# Altium schematic sheet S3 - CONNECTORS.SchDoc: CONNECTORS AND HEADERS
size A; FIELD_1: 1; FIELD_2: 2; FIELD_3: 3; FIELD_4: 4; FIELD_5: 5; FIELD_6: 6; FIELD_7: 7; FIELD_8: 8; Engineer: M. TALEBI; Organization: MACHINE INTELLIGENCE LAB; Revision: 0; Project: BLUETOOTH SYSTEM STATUS BOARD
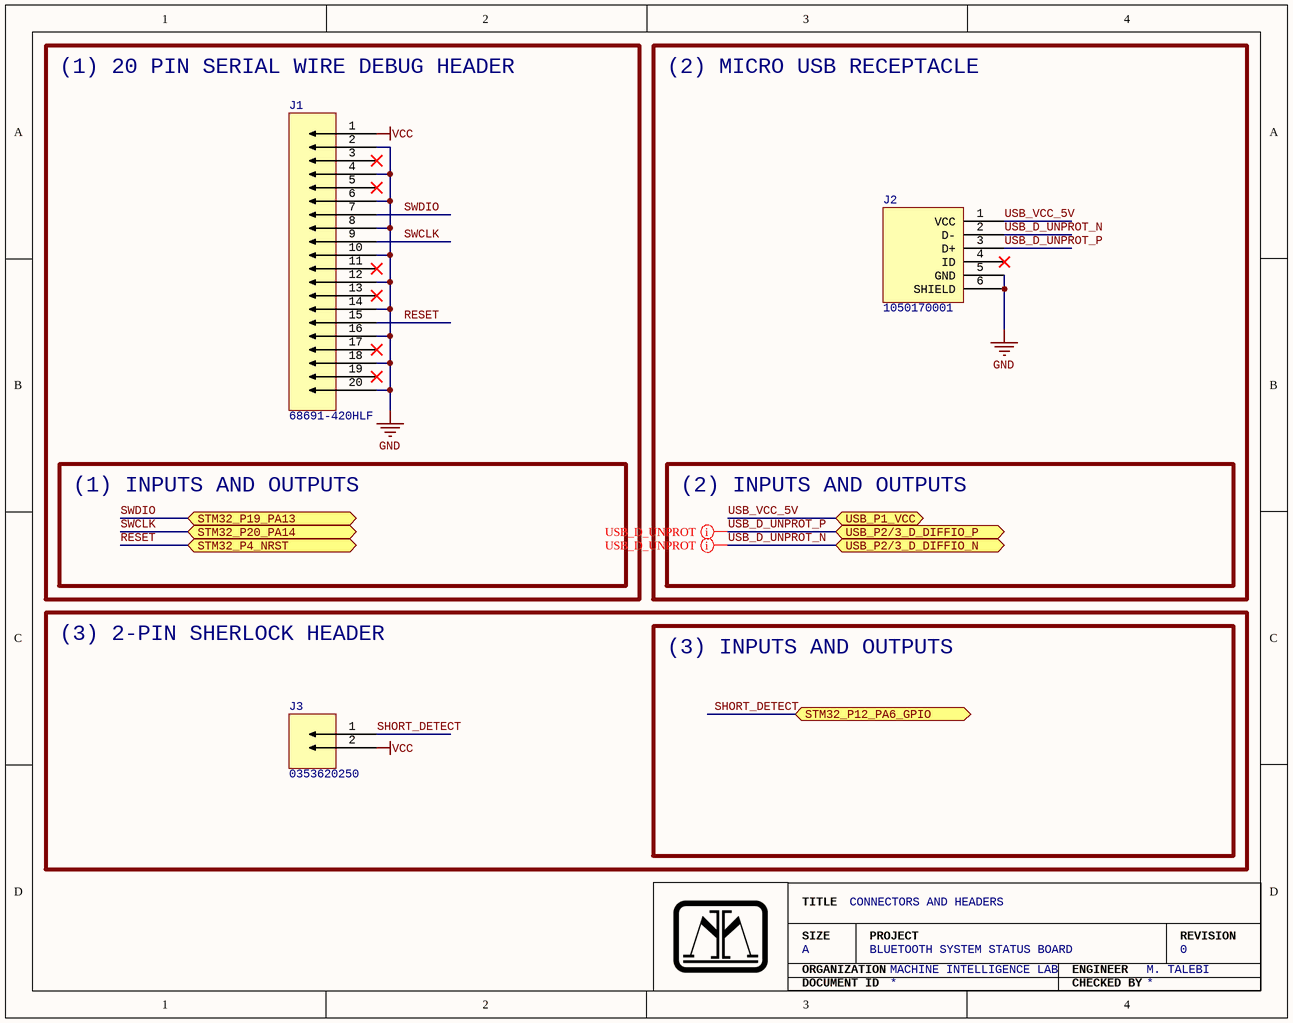
[diagram p0: S3 - CONNECTORS.SchDoc]

## Parts
J1  68691-420HLF  [68691-420HLF]
J2  1050170001  [1050170001]
J3  0353620250  [0353620250]

## Ports
STM32_P4_NRST (bidir), STM32_P12_PA6_GPIO (bidir), STM32_P19_PA13 (bidir), STM32_P20_PA14 (bidir), USB_P1_VCC (bidir), USB_P2/3_D_DIFFIO_N (bidir), USB_P2/3_D_DIFFIO_P (bidir)

## Nets
GND: J1.2 J1.4 J1.6 J1.8 J1.10 J1.12 J1.14 J1.16 J1.18 J1.20 J2.5(GND) J2.6(SHIELD)
VCC: J1.1 J3.2
RESET: J1.15 ; port STM32_P4_NRST
SHORT_DETECT: J3.1 ; port STM32_P12_PA6_GPIO
SWCLK: J1.9 ; port STM32_P20_PA14
SWDIO: J1.7 ; port STM32_P19_PA13
USB_D_UNPROT_N: J2.2(D-) ; port USB_P2/3_D_DIFFIO_N
USB_D_UNPROT_P: J2.3(D+) ; port USB_P2/3_D_DIFFIO_P
USB_VCC_5V: J2.1(VCC) ; port USB_P1_VCC

Not connected (* = marked no-connect by the designer): J1 3(36)* 5(38)* 11(44)* 13(46)* 17(50)* 19(52)*; J2 4(ID)*

## Layout directives
differential pair: USB_D_UNPROT_N, USB_D_UNPROT_P

## Notes on the sheet
- (1) 20 PIN SERIAL WIRE DEBUG HEADER
- (2) MICRO USB RECEPTACLE
- (1) INPUTS AND OUTPUTS
- (2) INPUTS AND OUTPUTS
- (3) 2-PIN SHERLOCK HEADER
- (3) INPUTS AND OUTPUTS
- TITLE
- SIZE
- ORGANIZATION
- A
- PROJECT
- ENGINEER
- REVISION
- DOCUMENT ID
- CHECKED BY

## Library data of the parts
J1 = 68691-420HLF: CONN HEADER VERT 20POS 2.54MM; Pitch - Mating: 0.100" (2.54mm); Number of Positions: 20; Number of Positions Loaded: All; Style: Board to Board; Shrouding: Unshrouded; Contact Length - Mating: 0.318" (8.08mm); Contact Length - Post: 0.120" (3.05mm); Overall Contact Length: 0.538" (13.67mm); Material Flammability Rating: UL94 V-0; Connector Type: Header; Contact Type: Male Pin; Number of Rows: 2; Row Spacing - Mating: 0.100" (2.54mm); Mounting Type: Through Hole; Termination: Solder; Fastening Type: Push-Pull; Insulation Height: 0.100" (2.54mm); Contact Shape: Square; Contact Finish - Mating: Tin; Contact Finish Thickness - Mating: 100.0µin (2.54µm); Contact Finish - Post: Tin; Contact Material: Phosphor Bronze; Insulation Color: Black; Supplier 1: Digi-Key; Supplier Part Number 1: 609-6378-ND
J2 = 1050170001: CONN RCPT USB2.0 MICRO B SMD R/A; Connector Type: USB - micro B; Number of Contacts: 5; Gender: Receptacle; Current Rating (Amps): 1A, 1.8A; Voltage - Rated: 30VAC; Mating Cycles: 10000; Shielding: Shielded; Material Flammability Rating: UL94 V-0; Number of Ports: 1; Specifications: USB 2.0; Mounting Type: Surface Mount, Right Angle; Through Hole; Mounting Feature: Horizontal; Termination: Solder; Features: Pick and Place, Solder Retention; Operating Temperature: -30°C ~ 85°C; Contact Finish: Gold; Shell/Shielding Material: Steel, Stainless; Insulation Color: Black; Supplier 1: Digi-Key; Supplier Part Number 1: WM1399CT-ND
J3 = 0353620250: CONN HEADER VERT 2POS 2MM; Pitch - Mating: 0.079" (2.00mm); Number of Positions: 2; Number of Positions Loaded: All; Style: Board to Cable/Wire; Shrouding: Shrouded - 4 Wall; Contact Length - Mating: 0.145" (3.70mm); Contact Length - Post: 0.130" (3.30mm); Material Flammability Rating: UL94 V-0; Voltage Rating: 125V; Mated Stacking Heights: 8.5mm; Connector Type: Header; Contact Type: Male Pin; Number of Rows: 1; Mounting Type: Through Hole; Termination: Solder; Fastening Type: Locking Ramp; Insulation Height: 0.335" (8.51mm); Contact Shape: Square; Contact Finish - Mating: Tin; Contact Finish Thickness - Mating: 39.4µin (1.00µm); Contact Finish - Post: Tin; Contact Material: Brass; Insulation Material: Polyamide (PA), Nylon; Operating Temperature: -40°C ~ 105°C; Insulation Color: Natural; Contact Finish Thickness - Post: 39.4µin (1.00µm); Applications: Automotive, General Purpose; ComponentLink1Description: Datasheet; ComponentLink1URL: https://media.digikey.com/pdf/Data%20Sheets/Molex%20PDFs/PS-35507-003.pdf